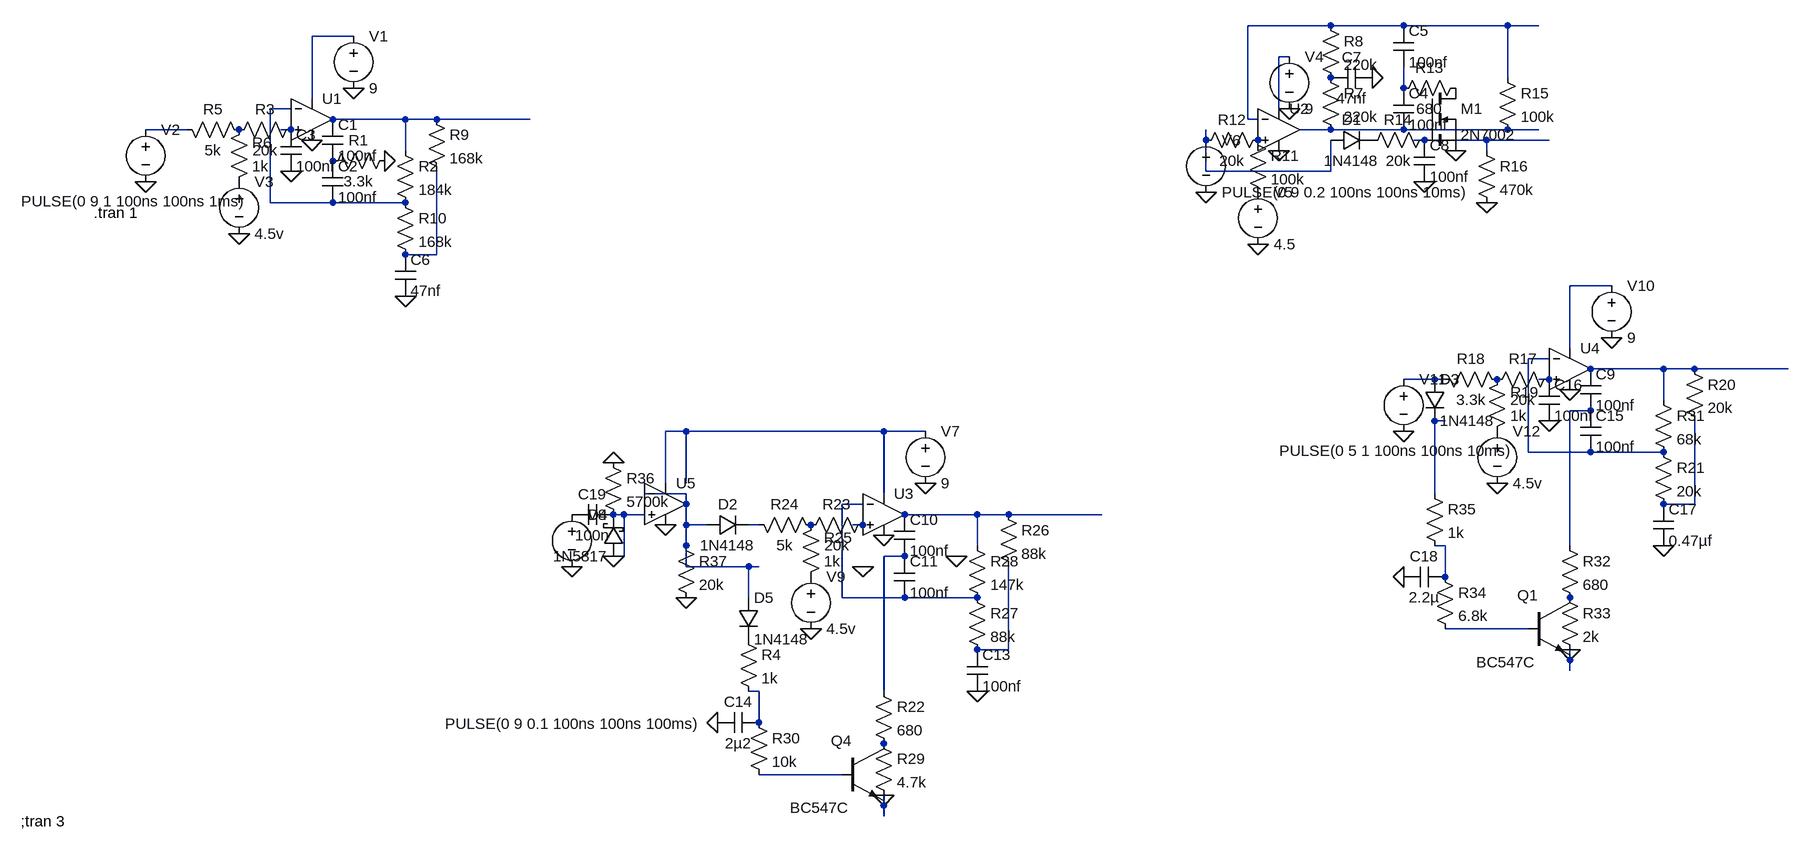
[diagram p0: schematic DrumOscillatorTest.asc]
DrumOscillatorTest.asc, the LTspice schematic file:
Version 4
SHEET 1 2808 1880
WIRE 1744 0 1616 0
WIRE 1856 0 1744 0
WIRE 2016 0 1856 0
WIRE 2064 0 2016 0
WIRE 240 16 176 16
WIRE 1680 48 1664 48
WIRE 2016 80 2016 0
WIRE 1856 96 1856 64
WIRE 176 112 176 16
WIRE 144 128 112 128
WIRE 1664 128 1664 48
WIRE 320 144 208 144
WIRE 368 144 320 144
WIRE 512 144 368 144
WIRE 1616 144 1616 0
WIRE 1632 144 1616 144
WIRE -16 160 -80 160
WIRE 144 160 128 160
WIRE 1744 160 1696 160
WIRE 1856 160 1744 160
WIRE 2016 160 1856 160
WIRE 2064 160 2016 160
WIRE 1552 176 1552 160
WIRE 1888 176 1872 176
WIRE 1984 176 1888 176
WIRE 2080 176 1984 176
WIRE 320 192 320 144
WIRE 1984 192 1984 176
WIRE 1552 224 1552 176
WIRE 1744 224 1744 176
WIRE 1744 224 1552 224
WIRE 112 272 112 128
WIRE 208 272 112 272
WIRE 320 272 208 272
WIRE 368 352 368 224
WIRE 368 352 320 352
WIRE 2176 400 2112 400
WIRE 2112 496 2112 400
WIRE 2080 512 2048 512
WIRE 2256 528 2144 528
WIRE 2304 528 2256 528
WIRE 2448 528 2304 528
WIRE 1904 544 1856 544
WIRE 1920 544 1904 544
WIRE 2080 544 2064 544
WIRE 2256 576 2256 528
WIRE 2144 592 2112 592
WIRE 1920 608 1904 608
WIRE 752 624 720 624
WIRE 1056 624 752 624
WIRE 1120 624 1056 624
WIRE 2048 656 2048 512
WIRE 2144 656 2048 656
WIRE 2256 656 2144 656
WIRE 720 704 720 624
WIRE 752 704 752 624
WIRE 752 720 688 720
WIRE 1056 720 1056 624
WIRE 1904 720 1904 608
WIRE 752 736 752 720
WIRE 1024 736 992 736
WIRE 2304 736 2304 608
WIRE 2304 736 2256 736
WIRE 656 752 640 752
WIRE 688 752 656 752
WIRE 1200 752 1088 752
WIRE 1248 752 1200 752
WIRE 1392 752 1248 752
WIRE 752 768 752 736
WIRE 784 768 752 768
WIRE 864 768 848 768
WIRE 1024 768 1008 768
WIRE 752 800 752 768
WIRE 1200 800 1200 752
WIRE 1920 800 1904 800
WIRE 2112 800 2112 592
WIRE 656 816 656 752
WIRE 1088 816 1056 816
WIRE 752 832 752 800
WIRE 848 832 752 832
WIRE 864 832 848 832
WIRE 1920 848 1920 800
WIRE 848 880 848 832
WIRE 992 880 992 736
WIRE 1088 880 992 880
WIRE 1200 880 1088 880
WIRE 2048 928 1920 928
WIRE 1248 960 1248 832
WIRE 1248 960 1200 960
WIRE 2112 976 2112 960
WIRE 2112 992 2112 976
WIRE 864 1024 848 1024
WIRE 1056 1024 1056 816
WIRE 864 1072 864 1024
WIRE 992 1152 864 1152
WIRE 1056 1200 1056 1184
WIRE 1056 1216 1056 1200
FLAG -80 240 0
FLAG 176 176 0
FLAG 240 96 0
FLAG 288 208 0
FLAG 144 224 0
FLAG 64 320 0
FLAG 320 416 0
FLAG 576 832 0
FLAG 1056 784 0
FLAG 1120 704 0
FLAG 1168 816 0
FLAG 1024 832 0
FLAG 944 928 0
FLAG 1200 1024 0
FLAG 1056 1184 0
FLAG 800 1072 0
FLAG 1664 192 0
FLAG 1680 128 0
FLAG 1632 336 0
FLAG 1552 256 0
FLAG 1808 80 0
FLAG 1936 192 0
FLAG 1888 240 0
FLAG 1984 272 0
FLAG 1856 624 0
FLAG 2112 560 0
FLAG 2176 480 0
FLAG 2080 608 0
FLAG 2000 704 0
FLAG 2256 800 0
FLAG 2112 960 0
FLAG 1856 848 0
FLAG 640 816 0
FLAG 640 672 0
FLAG 752 880 0
FLAG 720 768 0
SYMBOL Opamps\\UniversalOpamp2 176 144 R0
SYMATTR InstName U1
SYMBOL voltage 240 0 R0
WINDOW 123 0 0 Left 0
WINDOW 39 0 0 Left 0
SYMATTR InstName V1
SYMATTR Value 9
SYMBOL voltage -80 144 R0
WINDOW 3 -191 126 Left 2
WINDOW 123 0 0 Left 0
WINDOW 39 0 0 Left 0
SYMATTR Value PULSE(0 9 1 100ns 100ns 1ms)
SYMATTR InstName V2
SYMBOL cap 192 144 R0
SYMATTR InstName C1
SYMATTR Value 100nf
SYMBOL cap 192 208 R0
SYMATTR InstName C2
SYMATTR Value 100nf
SYMBOL res 304 192 R90
WINDOW 0 0 56 VBottom 2
WINDOW 3 32 56 VTop 2
SYMATTR InstName R1
SYMATTR Value 3.3k
SYMBOL res 160 144 R90
WINDOW 0 0 56 VBottom 2
WINDOW 3 32 56 VTop 2
SYMATTR InstName R3
SYMATTR Value 20k
SYMBOL cap 128 160 R0
SYMATTR InstName C3
SYMATTR Value 100nf
SYMBOL res -32 144 M90
WINDOW 0 0 56 VBottom 2
WINDOW 3 32 56 VTop 2
SYMATTR InstName R5
SYMATTR Value 5k
SYMBOL res 48 256 M180
WINDOW 0 36 76 Left 2
WINDOW 3 36 40 Left 2
SYMATTR InstName R6
SYMATTR Value 1k
SYMBOL voltage 64 224 R0
WINDOW 123 0 0 Left 0
WINDOW 39 0 0 Left 0
SYMATTR InstName V3
SYMATTR Value 4.5v
SYMBOL res 352 128 R0
SYMATTR InstName R9
SYMATTR Value 168k
SYMBOL res 304 256 R0
SYMATTR InstName R10
SYMATTR Value 168k
SYMBOL cap 304 352 R0
SYMATTR InstName C6
SYMATTR Value 47nf
SYMBOL res 304 176 R0
SYMATTR InstName R2
SYMATTR Value 184k
SYMBOL Opamps\\UniversalOpamp2 1056 752 R0
SYMATTR InstName U3
SYMBOL voltage 1120 608 R0
WINDOW 123 0 0 Left 0
WINDOW 39 0 0 Left 0
SYMATTR InstName V7
SYMATTR Value 9
SYMBOL voltage 576 736 R0
WINDOW 3 -195 338 Left 2
WINDOW 123 0 0 Left 0
WINDOW 39 0 0 Left 0
SYMATTR Value PULSE(0 9 0.1 100ns 100ns 100ms)
SYMATTR InstName V8
SYMBOL cap 1072 752 R0
SYMATTR InstName C10
SYMATTR Value 100nf
SYMBOL cap 1072 816 R0
SYMATTR InstName C11
SYMATTR Value 100nf
SYMBOL res 1040 752 R90
WINDOW 0 0 56 VBottom 2
WINDOW 3 32 56 VTop 2
SYMATTR InstName R23
SYMATTR Value 20k
SYMBOL res 848 752 M90
WINDOW 0 0 56 VBottom 2
WINDOW 3 32 56 VTop 2
SYMATTR InstName R24
SYMATTR Value 5k
SYMBOL res 928 864 M180
WINDOW 0 36 76 Left 2
WINDOW 3 36 40 Left 2
SYMATTR InstName R25
SYMATTR Value 1k
SYMBOL voltage 944 832 R0
WINDOW 123 0 0 Left 0
WINDOW 39 0 0 Left 0
SYMATTR InstName V9
SYMATTR Value 4.5v
SYMBOL res 1232 736 R0
SYMATTR InstName R26
SYMATTR Value 88k
SYMBOL res 1184 864 R0
SYMATTR InstName R27
SYMATTR Value 88k
SYMBOL cap 1184 960 R0
SYMATTR InstName C13
SYMATTR Value 100nf
SYMBOL res 1184 784 R0
SYMATTR InstName R28
SYMATTR Value 147k
SYMBOL res 1040 1008 R0
SYMATTR InstName R22
SYMATTR Value 680
SYMBOL res 1040 1088 R0
SYMATTR InstName R29
SYMATTR Value 4.7k
SYMBOL npn 992 1104 R0
WINDOW 0 -17 -4 Left 2
WINDOW 3 -80 99 Left 2
SYMATTR InstName Q4
SYMATTR Value BC547C
SYMBOL diode 784 784 R270
WINDOW 0 32 32 VTop 2
WINDOW 3 0 32 VBottom 2
SYMATTR InstName D2
SYMATTR Value 1N4148
SYMBOL res 848 1056 R0
SYMATTR InstName R30
SYMATTR Value 10k
SYMBOL res 832 928 R0
SYMATTR InstName R4
SYMATTR Value 1k
SYMBOL Opamps\\UniversalOpamp2 1664 160 R0
SYMATTR InstName U2
SYMBOL voltage 1680 32 R0
WINDOW 123 0 0 Left 0
WINDOW 39 0 0 Left 0
SYMATTR InstName V4
SYMATTR Value 9
SYMBOL res 1728 64 R0
SYMATTR InstName R7
SYMATTR Value 220k
SYMBOL res 1728 -16 R0
SYMATTR InstName R8
SYMATTR Value 220k
SYMBOL cap 1840 96 R0
SYMATTR InstName C4
SYMATTR Value 100nf
SYMBOL cap 1840 0 R0
SYMATTR InstName C5
SYMATTR Value 100nf
SYMBOL res 1616 160 R0
SYMATTR InstName R11
SYMATTR Value 100k
SYMBOL res 1648 160 R90
WINDOW 0 0 56 VBottom 2
WINDOW 3 32 56 VTop 2
SYMATTR InstName R12
SYMATTR Value 20k
SYMBOL voltage 1632 240 R0
WINDOW 123 0 0 Left 0
WINDOW 39 0 0 Left 0
SYMATTR InstName V5
SYMATTR Value 4.5
SYMBOL voltage 1552 160 R0
WINDOW 123 0 0 Left 0
WINDOW 39 0 0 Left 0
SYMATTR InstName V6
SYMATTR Value PULSE(0 9 0.2 100ns 100ns 10ms)
SYMBOL res 1952 80 R90
WINDOW 0 0 56 VBottom 2
WINDOW 3 32 56 VTop 2
SYMATTR InstName R13
SYMATTR Value 680
SYMBOL cap 1808 64 R90
WINDOW 0 0 32 VBottom 2
WINDOW 3 32 32 VTop 2
SYMATTR InstName C7
SYMATTR Value 47nf
SYMBOL nmos 1888 96 R0
SYMATTR InstName M1
SYMATTR Value 2N7002
SYMBOL res 1904 160 R90
WINDOW 0 0 56 VBottom 2
WINDOW 3 32 56 VTop 2
SYMATTR InstName R14
SYMATTR Value 20k
SYMBOL cap 1872 176 R0
SYMATTR InstName C8
SYMATTR Value 100nf
SYMBOL res 2000 64 R0
SYMATTR InstName R15
SYMATTR Value 100k
SYMBOL diode 1744 192 R270
WINDOW 0 32 32 VTop 2
WINDOW 3 0 32 VBottom 2
SYMATTR InstName D1
SYMATTR Value 1N4148
SYMBOL res 1968 176 R0
SYMATTR InstName R16
SYMATTR Value 470k
SYMBOL Opamps\\UniversalOpamp2 2112 528 R0
SYMATTR InstName U4
SYMBOL voltage 2176 384 R0
WINDOW 123 0 0 Left 0
WINDOW 39 0 0 Left 0
SYMATTR InstName V10
SYMATTR Value 9
SYMBOL voltage 1856 528 R0
WINDOW 3 -191 126 Left 2
WINDOW 123 0 0 Left 0
WINDOW 39 0 0 Left 0
SYMATTR Value PULSE(0 5 1 100ns 100ns 10ms)
SYMATTR InstName V11
SYMBOL cap 2128 528 R0
SYMATTR InstName C9
SYMATTR Value 100nf
SYMBOL cap 2128 592 R0
SYMATTR InstName C15
SYMATTR Value 100nf
SYMBOL res 2096 528 R90
WINDOW 0 0 56 VBottom 2
WINDOW 3 32 56 VTop 2
SYMATTR InstName R17
SYMATTR Value 20k
SYMBOL cap 2064 544 R0
SYMATTR InstName C16
SYMATTR Value 100nf
SYMBOL res 1904 528 M90
WINDOW 0 0 56 VBottom 2
WINDOW 3 32 56 VTop 2
SYMATTR InstName R18
SYMATTR Value 3.3k
SYMBOL res 1984 640 M180
WINDOW 0 36 76 Left 2
WINDOW 3 36 40 Left 2
SYMATTR InstName R19
SYMATTR Value 1k
SYMBOL voltage 2000 608 R0
WINDOW 123 0 0 Left 0
WINDOW 39 0 0 Left 0
SYMATTR InstName V12
SYMATTR Value 4.5v
SYMBOL res 2288 512 R0
SYMATTR InstName R20
SYMATTR Value 20k
SYMBOL res 2240 640 R0
SYMATTR InstName R21
SYMATTR Value 20k
SYMBOL cap 2240 736 R0
SYMATTR InstName C17
SYMATTR Value 0.47µf
SYMBOL res 2240 560 R0
SYMATTR InstName R31
SYMATTR Value 68k
SYMBOL res 2096 784 R0
SYMATTR InstName R32
SYMATTR Value 680
SYMBOL res 2096 864 R0
SYMATTR InstName R33
SYMATTR Value 2k
SYMBOL npn 2048 880 R0
WINDOW 0 -17 -4 Left 2
WINDOW 3 -80 99 Left 2
SYMATTR InstName Q1
SYMATTR Value BC547C
SYMBOL diode 1888 544 R0
SYMATTR InstName D3
SYMATTR Value 1N4148
SYMBOL res 1904 832 R0
SYMATTR InstName R34
SYMATTR Value 6.8k
SYMBOL cap 1920 832 R90
WINDOW 0 0 32 VBottom 2
WINDOW 3 32 32 VTop 2
SYMATTR InstName C18
SYMATTR Value 2.2µ
SYMBOL res 1888 704 R0
SYMATTR InstName R35
SYMATTR Value 1k
SYMBOL cap 640 736 R90
WINDOW 0 0 32 VBottom 2
WINDOW 3 32 32 VTop 2
SYMATTR InstName C19
SYMATTR Value 100n
SYMBOL schottky 656 816 R180
WINDOW 0 24 64 Left 2
WINDOW 3 24 0 Left 2
SYMATTR InstName D4
SYMATTR Value 1N5817
SYMATTR Description Diode
SYMATTR Type diode
SYMBOL res 624 656 R0
SYMATTR InstName R36
SYMATTR Value 5700k
SYMBOL res 736 784 R0
SYMATTR InstName R37
SYMATTR Value 20k
SYMBOL Opamps\\UniversalOpamp2 720 736 R0
SYMATTR InstName U5
SYMBOL cap 800 1088 R270
WINDOW 0 32 32 VTop 2
WINDOW 3 0 32 VBottom 2
SYMATTR InstName C14
SYMATTR Value 2µ2
SYMBOL diode 832 880 R0
SYMATTR InstName D5
SYMATTR Value 1N4148
TEXT -160 288 Left 2 !.tran 1
TEXT -272 1224 Left 2 !;tran 3

The netlist it stands for:
* DrumOscillatorTest.asc
XU1 N008 N005 N002 0 N006 level.2 Avol=1Meg GBW=10Meg Slew=10Meg ilimit=25m rail=0 Vos=0 phimargin=45 en=0 enk=0 in=0 ink=0 Rin=500Meg  ; pins IN+ IN- V+ V- OUT
V1 N002 0 9
V2 N007 0 PULSE(0 9 1 100ns 100ns 1ms)
C1 N006 P001 100nf
C2 P001 N005 100nf
R1 0 P001 3.3k
R3 N008 P002 20k
C3 N008 0 100nf
R5 N007 P002 5k
R6 P003 P002 1k
V3 P003 0 4.5v
R9 N006 N012 168k
R10 N005 N012 168k
C6 N012 0 47nf
R2 N006 N005 184k
XU3 N027 N022 N020 0 N025 level.2 Avol=1Meg GBW=10Meg Slew=10Meg ilimit=25m rail=0 Vos=0 phimargin=45 en=0 enk=0 in=0 ink=0 Rin=500Meg  ; pins IN+ IN- V+ V- OUT
V7 N020 0 9
V8 P004 0 PULSE(0 9 0.1 100ns 100ns 100ms)
C10 N025 N029 100nf
C11 N029 N022 100nf
R23 N027 P005 20k
R24 N026 P005 5k
R25 P006 P005 1k
V9 P006 0 4.5v
R26 N025 N031 88k
R27 N022 N031 88k
C13 N031 0 100nf
R28 N025 N022 147k
R22 N029 P007 680
R29 P007 0 4.7k
Q4 P007 N033 0 0 BC547C
D2 N021 N026 1N4148
R30 N032 N033 10k
R4 P008 N032 1k
XU2 P009 N001 N003 0 N009 level.2 Avol=1Meg GBW=10Meg Slew=10Meg ilimit=25m rail=0 Vos=0 phimargin=45 en=0 enk=0 in=0 ink=0 Rin=500Meg  ; pins IN+ IN- V+ V- OUT
V4 N003 0 9
R7 P010 N009 220k
R8 N001 P010 220k
C4 N004 N009 100nf
C5 N001 N004 100nf
R11 P009 P011 100k
R12 P009 N010 20k
V5 P011 0 4.5
V6 N010 0 PULSE(0 9 0.2 100ns 100ns 10ms)
R13 P012 N004 680
C7 0 P010 47nf
M1 P012 N011 0 0 2N7002
R14 N011 P013 20k
C8 N011 0 100nf
R15 N001 N009 100k
D1 N010 P013 1N4148
R16 N011 0 470k
XU4 N017 N014 N013 0 N015 level.2 Avol=1Meg GBW=10Meg Slew=10Meg ilimit=25m rail=0 Vos=0 phimargin=45 en=0 enk=0 in=0 ink=0 Rin=500Meg  ; pins IN+ IN- V+ V- OUT
V10 N013 0 9
V11 N016 0 PULSE(0 5 1 100ns 100ns 10ms)
C9 N015 N018 100nf
C15 N018 N014 100nf
R17 N017 P014 20k
C16 N017 0 100nf
R18 N016 P014 3.3k
R19 P015 P014 1k
V12 P015 0 4.5v
R20 N015 N023 20k
R21 N014 N023 20k
C17 N023 0 0.47µf
R31 N015 N014 68k
R32 N018 P016 680
R33 P016 0 2k
Q1 P016 N030 0 0 BC547C
D3 N016 N019 1N4148
R34 N028 N030 6.8k
C18 N028 0 2.2µ
R35 N019 N028 1k
C19 N024 P004 100n
D4 0 N024 1N5817
R36 0 N024 5700k
R37 N021 0 20k
XU5 N024 N021 N020 0 N021 level.2 Avol=1Meg GBW=10Meg Slew=10Meg ilimit=25m rail=0 Vos=0 phimargin=45 en=0 enk=0 in=0 ink=0 Rin=500Meg  ; pins IN+ IN- V+ V- OUT
C14 0 N032 2µ2
D5 N021 P008 1N4148
.model D D
.lib standard.dio
.model NPN NPN
.model PNP PNP
.lib standard.bjt
.model NMOS NMOS
.model PMOS PMOS
.lib standard.mos
.tran 1
;tran 3
.lib UniversalOpamps2.sub
.backanno
.end